# EAGLE design FIDO2AUTH_002 (EAGLE 7.7.0)

## Sheet 1 of 3
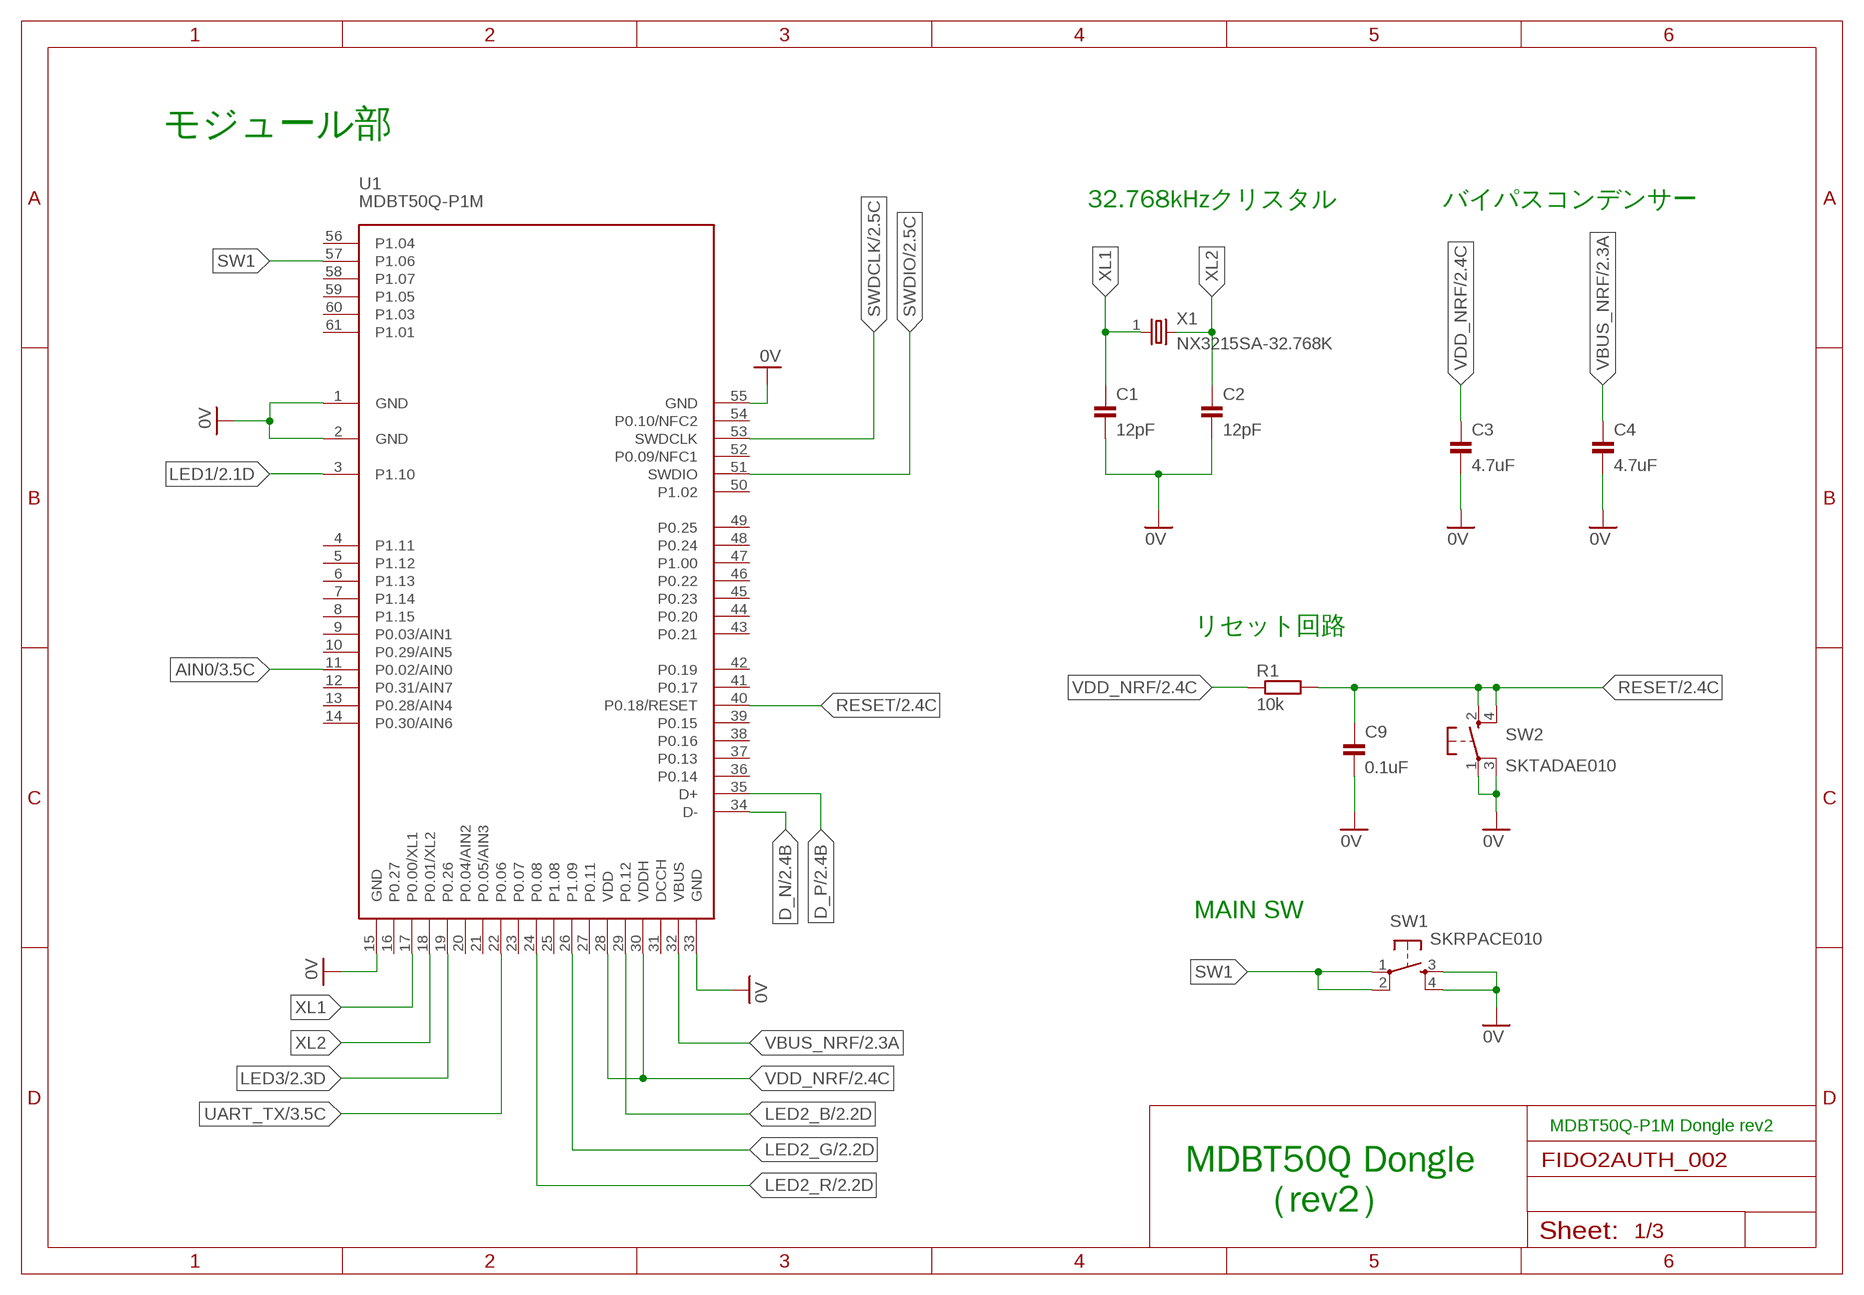
[diagram p0: schematic, sheet 1]

### Parts
C1  12pF  CAP_0603  [C0603K]
C2  12pF  CAP_0603  [C0603K]
C3  4.7uF  CAP_0603  [C0603K]
C4  4.7uF  CAP_0603  [C0603K]
C9  0.1uF  CAP_0603  [C0603K]
R1  10k  RESISTOR_0603  [R0603]
SW1  SKRPACE010  [SKRPACE010]
SW2  SKTADAE010  [SKTADAE010]
U1  MDBT50Q-P1M  [MDBT50Q-P1M]
X1  NX3215SA-32.768K  [NX3215]

### Nets
0V: C1.2 C2.2 C3.2 C4.2 C9.2 SW1.3(S) SW1.4(S1) SW2.1(P) SW2.3(P1) U1.1(GND) U1.2(GND) U1.15(GND) U1.33(GND) U1.55(GND) ; also sheet 2,3
AIN0: U1.11(P0.02/AIN0) ; also sheet 3
D_N: U1.34(D-) ; also sheet 2
D_P: U1.35(D+) ; also sheet 2
LED1: U1.3(P1.10) ; also sheet 2
LED2_B: U1.29(P0.12) ; also sheet 2
LED2_G: U1.26(P1.09) ; also sheet 2
LED2_R: U1.24(P0.08) ; also sheet 2
LED3: U1.19(P0.26) ; also sheet 2
RESET: C9.1 R1.2 SW2.2(S) SW2.4(S1) U1.40(P0.18/RESET) ; also sheet 2
SW1: SW1.1(P) SW1.2(P1) U1.57(P1.06)
SWDCLK: U1.53(SWDCLK) ; also sheet 2
SWDIO: U1.51(SWDIO) ; also sheet 2
UART_TX: U1.22(P0.06) ; also sheet 3
VBUS_NRF: C4.1 U1.32(VBUS) ; also sheet 2,3
VDD_NRF: C3.1 R1.1 U1.28(VDD) U1.30(VDDH) ; also sheet 2,3
XL1: C1.1 U1.17(P0.00/XL1) X1.1
XL2: C2.1 U1.18(P0.01/XL2) X1.2
Unconnected: U1.4(P1.11) U1.5(P1.12) U1.6(P1.13) U1.7(P1.14) U1.8(P1.15) U1.9(P0.03/AIN1) U1.10(P0.29/AIN5) U1.12(P0.31/AIN7) U1.13(P0.28/AIN4) U1.14(P0.30/AIN6) U1.16(P0.27) U1.20(P0.04/AIN2) U1.21(P0.05/AIN3) U1.23(P0.07) U1.25(P1.08) U1.27(P0.11) U1.31(DCCH) U1.36(P0.14) U1.37(P0.13) U1.38(P0.16) U1.39(P0.15) U1.41(P0.17) U1.42(P0.19) U1.43(P0.21) U1.44(P0.20) U1.45(P0.23) U1.46(P0.22) U1.47(P1.00) U1.48(P0.24) U1.49(P0.25) U1.50(P1.02) U1.52(P0.09/NFC1) U1.54(P0.10/NFC2) U1.56(P1.04) U1.58(P1.07) U1.59(P1.05) U1.60(P1.03) U1.61(P1.01)

### Notes on the sheet
- モジュール部
- 32.768kHzクリスタル | バイパスコンデンサー
- リセット回路
- MAIN SW
- MDBT50Q-P1M Dongle rev2
- MDBT50Q Dongle
        （rev2）

## Sheet 2 of 3
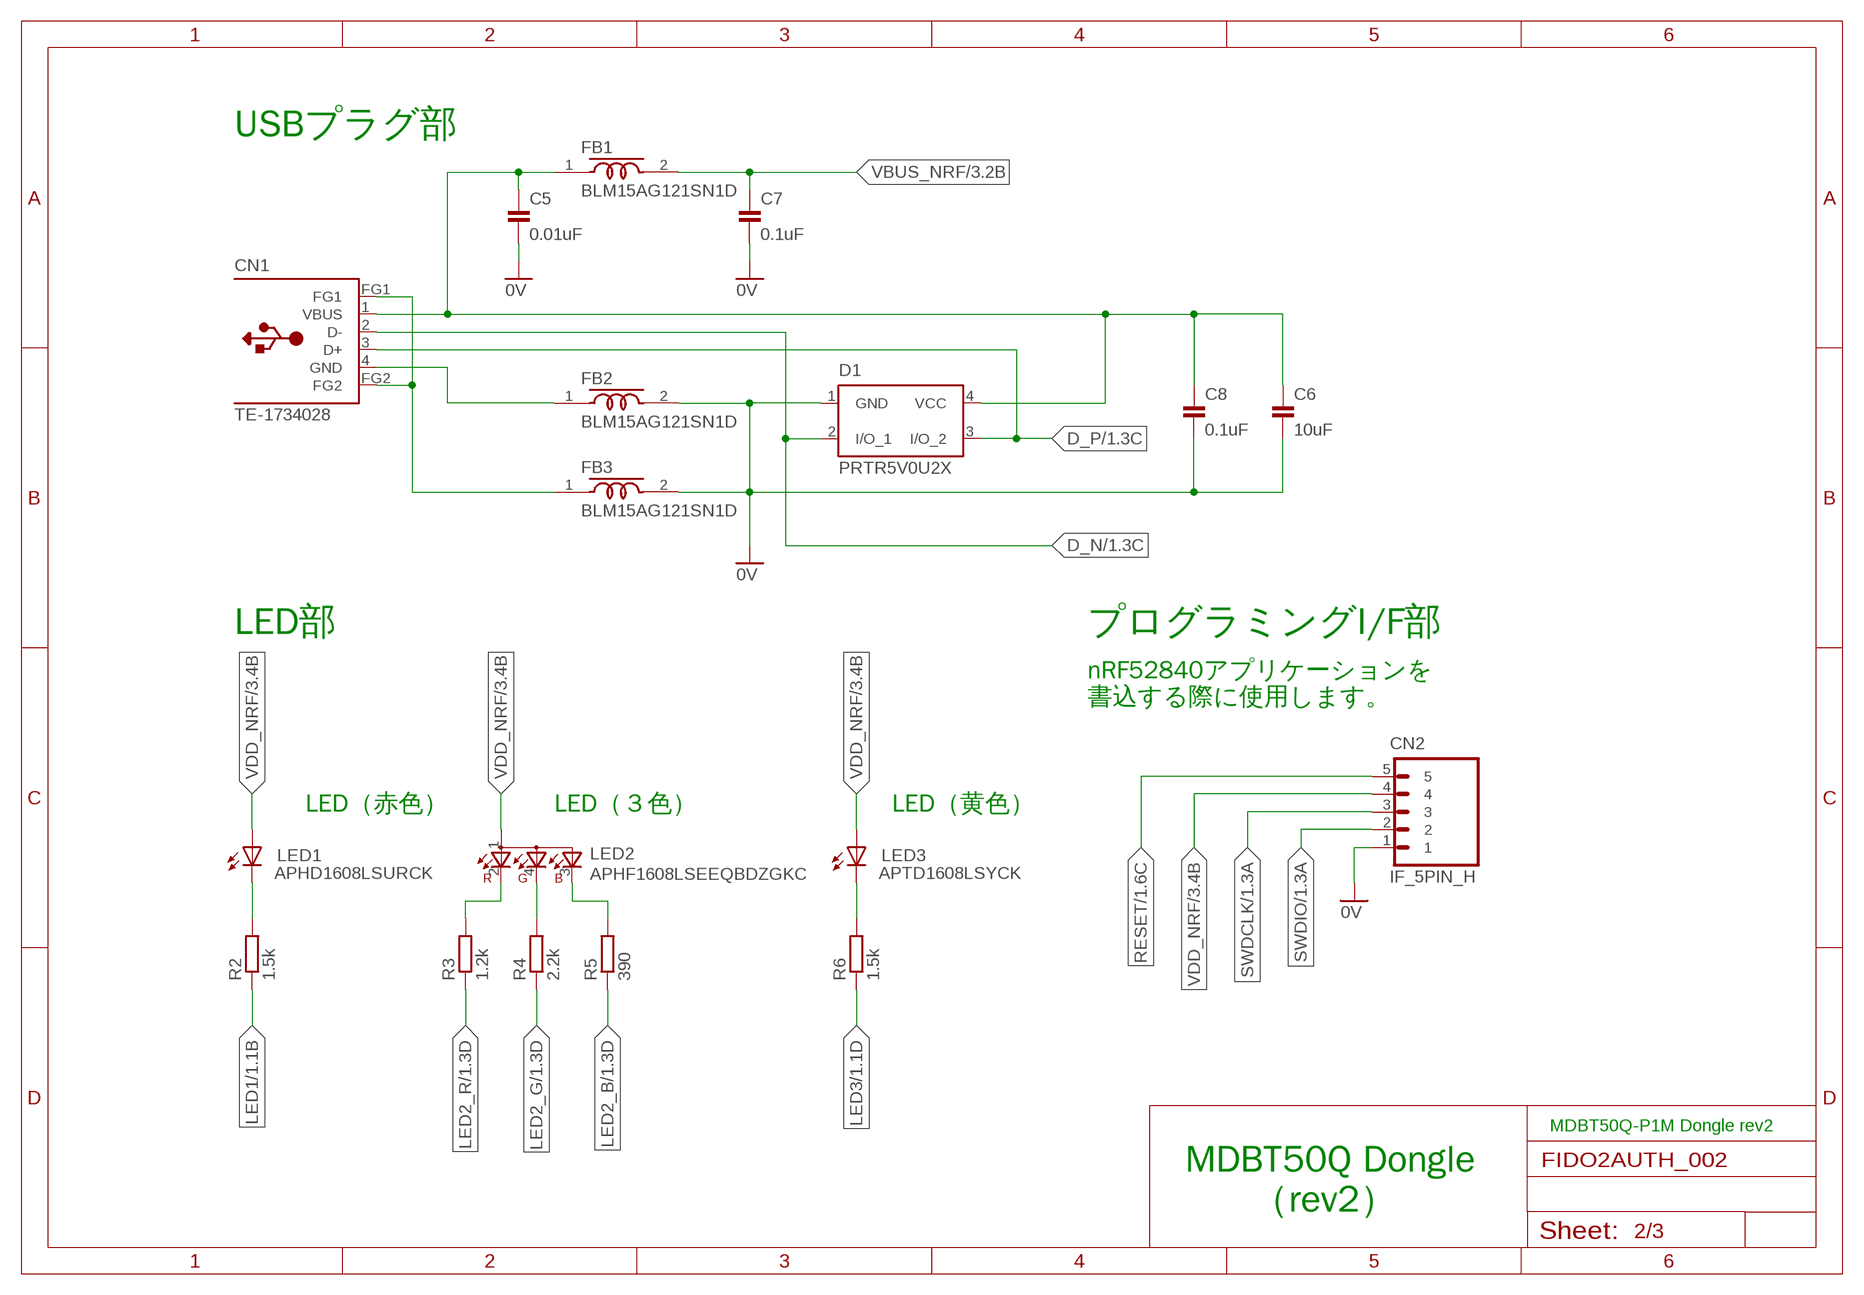
[diagram p1: schematic, sheet 2]

### Parts
C5  0.01uF  CAP_0603  [C0603K]
C6  10uF  CAP_0603  [C0603K]
C7  0.1uF  CAP_0603  [C0603K]
C8  0.1uF  CAP_0603  [C0603K]
CN1  TE-1734028  [TE-1734028]
CN2  IF_5PIN_H  [HEADER_5PIN]
D1  PRTR5V0U2X  [SOT143B]
FB1  BLM15AG121SN1D  [C0402K@1]
FB2  BLM15AG121SN1D  [C0402K@1]
FB3  BLM15AG121SN1D  [C0402K@1]
LED1  APHD1608LSURCK  [CHIPLED_0603]
LED2  APHF1608LSEEQBDZGKC  [APHF1608LSEEQBDZGKC]
LED3  APTD1608LSYCK  [CHIPLED_0603]
R2  1.5k  RESISTOR_0603  [R0603]
R3  1.2k  RESISTOR_0603  [R0603]
R4  2.2k  RESISTOR_0603  [R0603]
R5  390  RESISTOR_0603  [R0603]
R6  1.5k  RESISTOR_0603  [R0603]

### Nets
0V: C5.2 C6.2 C7.2 C8.2 CN2.1 D1.1(GND) FB2.2 FB3.2 ; also sheet 1,3
D_N: CN1.2(D-) D1.2(I/O_1) ; also sheet 1
D_P: CN1.3(D+) D1.3(I/O_2) ; also sheet 1
LED1: R2.1 ; also sheet 1
LED2_B: R5.1 ; also sheet 1
LED2_G: R4.1 ; also sheet 1
LED2_R: R3.1 ; also sheet 1
LED3: R6.1 ; also sheet 1
N$1: LED2.2(CRED) R3.2
N$2: CN1.4(GND) FB2.1
N$3: CN1.FG1 CN1.FG2 FB3.1
N$6: LED2.4(CGREEN) R4.2
N$7: LED2.3(CBLUE) R5.2
N$8: LED3.C R6.2
N$11: LED1.C R2.2
RESET: CN2.5 ; also sheet 1
SWDCLK: CN2.3 ; also sheet 1
SWDIO: CN2.2 ; also sheet 1
VBUS: C5.1 C6.1 C8.1 CN1.1(VBUS) D1.4(VCC) FB1.1
VBUS_NRF: C7.1 FB1.2 ; also sheet 1,3
VDD_NRF: CN2.4 LED1.A LED2.1(A) LED3.A ; also sheet 1,3

### Notes on the sheet
- USBプラグ部
- LED部 | プログラミングI/F部
- nRF52840アプリケーションを
  書込する際に使用します。
- LED（赤色） | LED（３色） | LED（黄色）
- MDBT50Q-P1M Dongle rev2
- MDBT50Q Dongle
        （rev2）

## Sheet 3 of 3
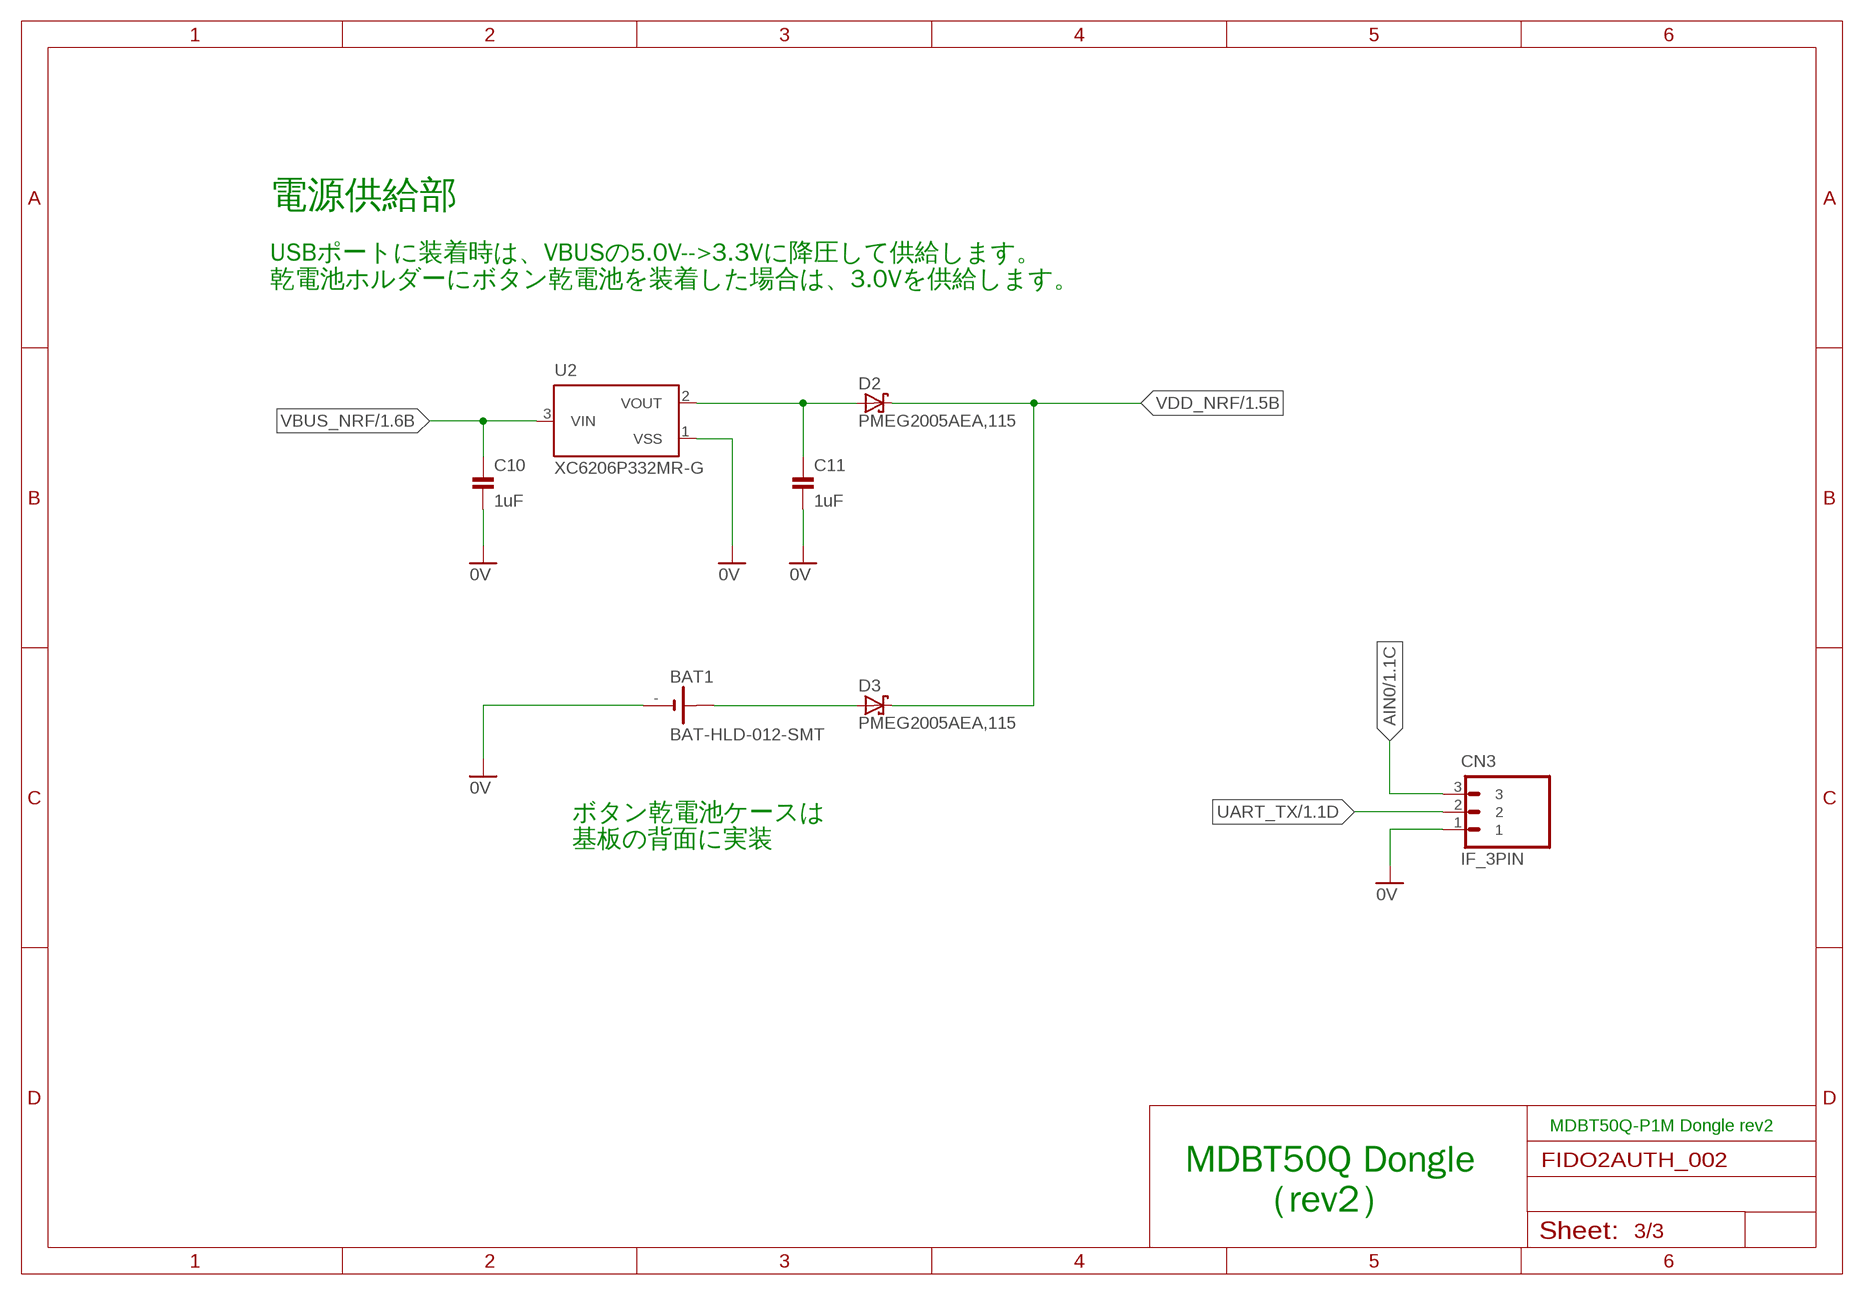
[diagram p2: schematic, sheet 3]

### Parts
BAT1  BAT-HLD-012-SMT  [BAT-HLD-012-SMT]
C10  1uF  CAP_0603  [C0603K]
C11  1uF  CAP_0603  [C0603K]
CN3  IF_3PIN  [HEADER_3PIN]
D2  PMEG2005AEA,115  [SOD323-W]
D3  PMEG2005AEA,115  [SOD323-W]
U2  XC6206P332MR-G  [SOT23]

### Nets
0V: BAT1.- C10.2 C11.2 CN3.1 U2.1(VSS) ; also sheet 1,2
AIN0: CN3.3 ; also sheet 1
N$4: C11.1 D2.A U2.2(VOUT)
N$5: BAT1.+@1(+) D3.A
UART_TX: CN3.2 ; also sheet 1
VBUS_NRF: C10.1 U2.3(VIN) ; also sheet 1,2
VDD_NRF: D2.C D3.C ; also sheet 1,2

### Notes on the sheet
- 電源供給部
- USBポートに装着時は、VBUSの5.0V-->3.3Vに降圧して供給します。
  乾電池ホルダーにボタン乾電池を装着した場合は、3.0Vを供給します。
- ボタン乾電池ケースは
  基板の背面に実装
- MDBT50Q-P1M Dongle rev2
- MDBT50Q Dongle
        （rev2）

## Library data of the parts
BAT1 = Connectors:BAT-HLD-012-SMT: ボタン電池ホルダー(CR1216/1225)
C1-C11 = Parts:CAP: コンデンサー
CN1 = Connectors:TE-1734028: USB connector plug TE Connectivity
CN2 = Connectors:IF_5PIN: 5-pin インターフェース
CN3 = Connectors:IF_3PIN: 3-pin インターフェース
D1 = Parts:PRTR5V0U2X: ESD protection diode
D2 D3 = Parts:PMEG2005: ショットキーダイオード If - 順電流: 500 mA Vrrm - 繰返し逆電圧: 20 V Vf - 順電圧: 0.39 V Ifsm - 順方向サージ電流: 10 A 最低動作温度: - 65 C 最高動作温度: + 150 C
FB1-FB3 = Parts:BLM15AG: フェライトビーズ EMIFIL®
LED1 = Parts:APHD1608: 発光ダイオード
LED2 = Parts:APHF1608: Chip LED RGB Source: http://document.sharpsma.com/files/GM1WA55311A_SS.pdf
LED3 = Parts:APTD1608: 発光ダイオード
R1-R6 = Parts:RESISTOR: 抵抗器
SW1 = Parts:SKRPACE010: 表面実装用タクトスイッチ ４．２×３．２ｍｍ小型重作動力タイプ ・作動力：２．５５Ｎ ・操作方向：垂直 ・移動量：０．２ｍｍ ・動作寿命：５０，０００ｃｙｃｌｅｓ （５ｍＡ ５ＶＤＣ） ・初期接触抵抗：最大５００ｍΩ
SW2 = Parts:SKTADAE010: 表面実装用タクトスイッチ 2.6×1.6ｍｍ小型重作動力タイプ ・作動力：2.4 N ・操作方向：垂直 ・移動量：0.11 mm ・定格：50 mA 12 VDC
U1 = Modules:MDBT50Q-P1M: MDBT50Q – P1M (PCB Antenna) Bluetooth 5, IEEE 802.15.4, 2.4 GHz transceiver ARM Cortex –M4 32-bit processor with FPU, 64 MHz Memory: 1MB flash / 256KB RAM ‧Supply voltage range 1.7V to 5.5V ‧On-chip DC/DC and LDO regulators with automated low current modes ‧Regulated supply for external components from 1.8V to 3.3V ‧0.4uA at 3V in System OFF mode, no RAM retention ‧1.5uA at 3V in System ON mode, no RAM retention, wake on RTC Working distance 1Mbps: up to 250 meters in open space 2Mbps: up to 120 meters in open space
U2 = Parts:XC6206: LDO電圧レギュレータ 出力電圧: 3.3 V 出力電流: 200 mA 入力電圧最大値: 6 V 最小入力電圧: 1.8 V 動作供給電流: 1 uA 最低動作温度: - 40 C 最高動作温度: + 85 C
X1 = Parts:NX3215SA: 水晶振動子 周波数 32.768kHz 周波数公差 ±20ppm 負荷容量 6pF ESR（等価直列抵抗） 70 kOhms 動作温度 -40°C～85°C

## Board
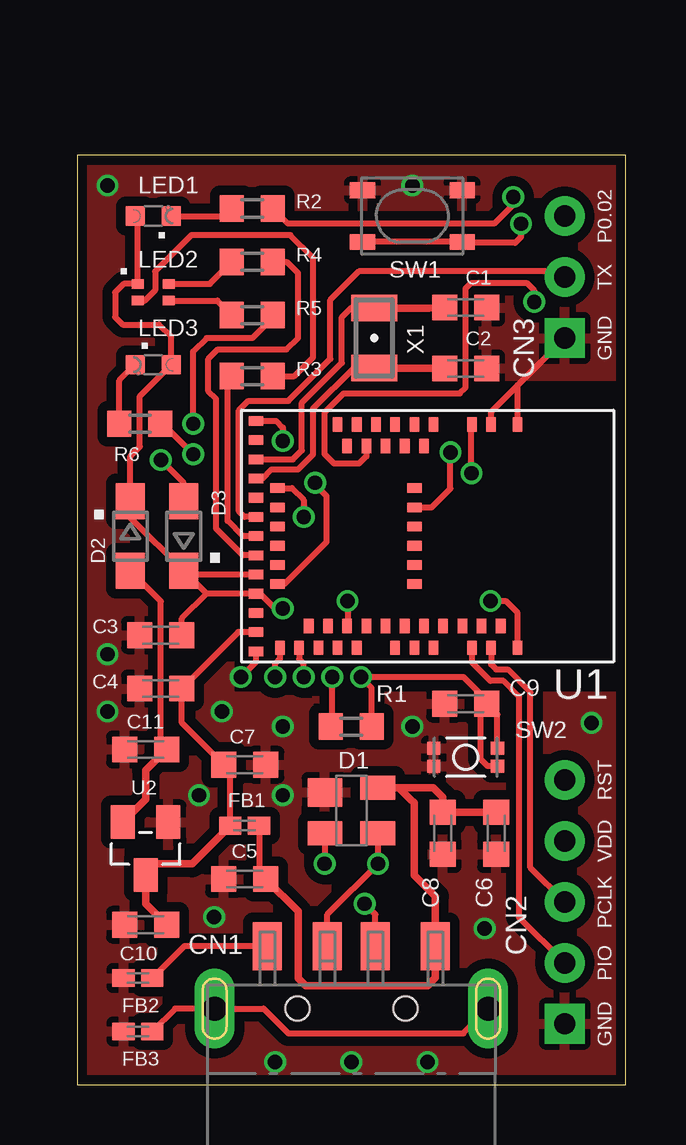
[diagram p3: board, top side]
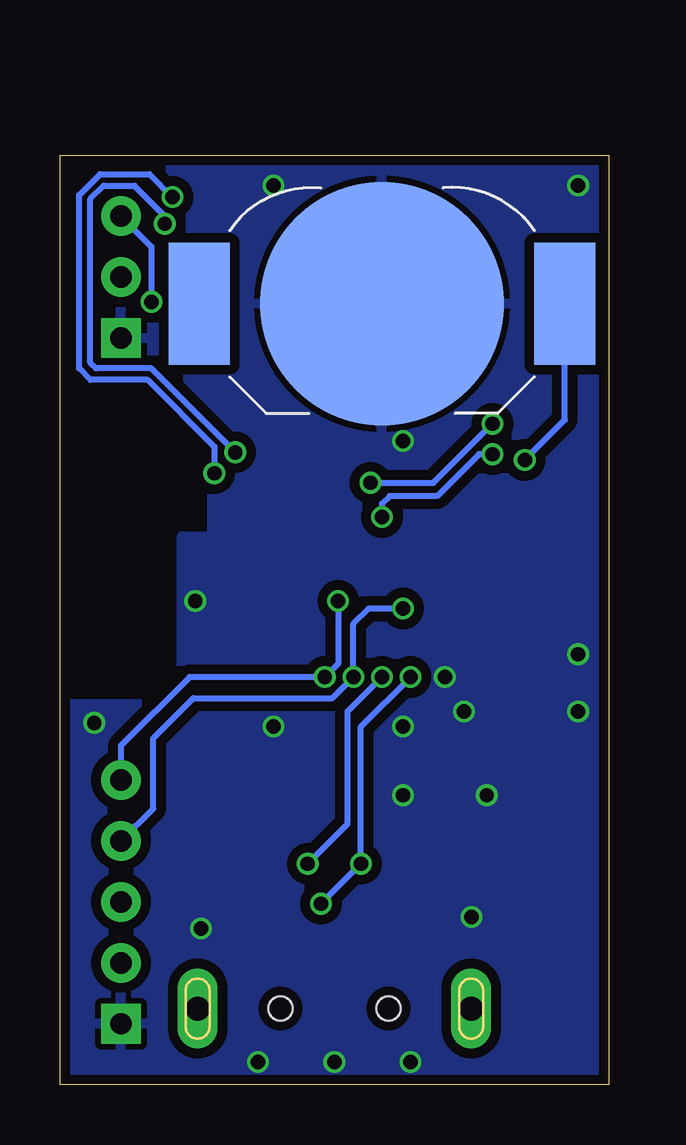
[diagram p4: board, bottom side, seen from below]

Size 22.86 x 38.73 mm. Coordinates in mm from the lower left corner, seen from the top.
Outline: 0,0 22.86,0 22.86,38.73 0,38.73 0,0
Copper layers (1*16): Top 0.035mm / dielectric 1.5mm / Bottom 0.035mm
Design rules "SeeedStudio_2layer_DRU_no_angle_20140221": minimum track width 6mil, minimum drill 12mil, track to track 6mil, track to pad 6mil, pad to pad 6mil, via to via 6mil, smd to smd 0mil, copper to edge 10mil, drill to drill 10mil, minimum pad ring 10mil, minimum via ring 6mil, stop-mask expansion 2mil, vias tented up to drill 100mil, thermal gap 10mil

### Footprints (pad centres in the part's own frame; a part is rotated, then mirrored left to right if it is on the bottom)
BAT-HLD-012-SMT = smd 2.54 x 5.08: +@1 -7.62,0; +@2 7.62,0 | smd 10.16 x 10.16: - 0,0
C0603K = smd 1.05 x 1.08: 1 -0.875,0; 2 0.875,0
TE-1734028 = smd 1.2 x 2: 1 3.5,2.6; 2 1,2.6; 3 -1,2.6; 4 -3.5,2.6 | drill 1 pad 1.676 long: FG1 5.7,0; FG2 -5.7,0 | hole 1: -2.25,0; 2.25,0
HEADER_5PIN = drill 0.889 pad 1.651 square: 1 0,0 | drill 0.889 pad 1.651: 2 2.54,0; 3 5.08,0; 4 7.62,0; 5 10.16,0
HEADER_3PIN = drill 0.889 pad 1.651 square: 1 0,0 | drill 0.889 pad 1.651: 2 2.54,0; 3 5.08,0
SOT143B = smd 1.2 x 1.44: 1 -0.75,-1.1 | smd 1 x 1.44: 2 0.95,-1.1; 3 0.95,1.1; 4 -0.95,1.1
SOD323-W = smd 1.5 x 1.2: A 1.45,0; C -1.45,0
C0402K@1 = smd 0.925 x 0.74: 1 -0.6,0; 2 0.6,0
CHIPLED_0603 = smd 0.8 x 0.8: A -0.75,0; C 0.75,0
APHF1608LSEEQBDZGKC = smd 0.5 x 0.4: 1 -0.65,0.35; 2 -0.65,-0.35; 3 0.65,-0.35; 4 0.65,0.35
R0603 = smd 1 x 1.1: 1 -0.85,0; 2 0.85,0
SKRPACE010 = smd 1.05 x 0.65: 1 -2.075,1.075; 2 2.075,1.075; 3 -2.075,-1.075; 4 2.075,-1.075
SKTADAE010 = smd 0.55 x 0.55: 1 -1.325,0.375; 2 1.325,0.375; 3 -1.325,-0.375; 4 1.325,-0.375
MDBT50Q-P1M = smd 0.6 x 0.4: 1 -4.65,3.75; 2 -4.65,2.65; 3 -4.65,1.85; 4 -4.65,0.25; 5 -3.75,-0.15; 6 -4.65,-0.55; 7 -3.75,-0.95; 8 -4.65,-1.35; 9 -3.75,-1.75; 10 -4.65,-2.15; 11 -3.75,-2.55; 12 -4.65,-2.95; 13 -3.75,-3.35; 14 -4.65,-3.75; 34 4.65,-6.15; 35 4.65,-5.35; 36 3.75,-4.95; 37 4.65,-4.55; 38 3.75,-4.15; 39 4.65,-3.75; 40 3.75,-3.35; 41 4.65,-2.95; 42 3.75,-2.55; 43 3.75,-1.75; 44 4.65,-1.35; 45 3.75,-0.95; 46 4.65,-0.55; 47 3.75,-0.15; 48 4.65,0.25; 49 3.75,0.65; 50 3.75,1.45; 51 4.65,1.85; 52 3.75,2.25; 53 4.65,2.65; 54 3.75,3.05; 55 4.65,3.75 | smd 0.4 x 0.6: 15 -4.8,-7.15; 16 -4,-7.15; 17 -3.2,-7.15; 18 -2.4,-7.15; 19 -2,-6.25; 20 -1.6,-7.15; 21 -1.2,-6.25; 22 -0.8,-7.15; 23 -0.4,-6.25; 24 0,-7.15; 25 0.4,-6.25; 26 0.8,-7.15; 27 1.2,-6.25; 28 1.6,-7.15; 29 2,-6.25; 30 2.4,-7.15; 31 3.2,-7.15; 32 4,-7.15; 33 4.8,-7.15; 56 -2,-0.55; 57 -1.2,-0.55; 58 -0.4,-0.55; 59 0.4,-0.55; 60 1.2,-0.55; 61 2,-0.55
SOT23 = smd 1 x 1.4: 1 -0.95,-1.1; 2 0.95,-1.1; 3 0,1.1
NX3215 = smd 1.1 x 1.9: 1 -1.25,0; 2 1.25,0

### Placement (x,y rotation side)
BAT1  9.45,32.54 180 bottom
C1  16.19,32.38 0 top
C2  16.19,29.84 0 top
C3  3.49,18.73 180 top
C4  3.49,16.51 180 top
C5  6.99,8.57 180 top
C6  17.46,10.48 270 top
C7  6.99,13.34 0 top
C8  15.24,10.48 270 top
C9  16.19,15.88 180 top
C10  2.86,6.67 180 top
C11  2.86,13.97 180 top
CN1  11.43,3.17 0 top
CN2  20.32,2.54 90 top
CN3  20.32,31.11 90 top
D1  11.43,11.43 270 top
D2  2.22,22.86 270 top
D3  4.45,22.86 90 top
FB1  6.99,10.79 180 top
FB2  2.54,4.45 180 top
FB3  2.54,2.22 180 top
LED1  3.17,36.2 0 top
LED2  3.17,33.02 0 top
LED3  3.17,30 180 top
R1  11.43,14.92 0 top
R2  7.3,36.51 180 top
R3  7.3,29.53 0 top
R4  7.3,34.29 180 top
R5  7.3,32.07 180 top
R6  2.62,27.54 180 top
SW1  13.97,36.2 180 top
SW2  16.19,13.65 0 top
U1  14.61,22.86 270 top
U2  2.86,9.84 180 top
X1  12.38,31.11 270 top

### Tracks (layer width: path | path; a pad name or v marks a point on that pad's centre or on a via)
0V  (via drill 0.6)
  Top 0.254: U1.55 18.36,19.67 17.86,20.16 v17.22,20.16 | U1.15 8.3,27.66 8.57,27.38 v8.57,26.83 | U1.33 7.46,17.61 v6.83,16.99 | U1.1 18.36,29.15 | 18.36,29.15 CN3.1 | U1.2 17.25,28.05 18.36,29.15
  other vias: 13.97,14.92 16.99,6.51 5.71,6.99 11.43,0.95 8.57,14.92 5.08,12.06 1.27,17.94 1.27,15.56 21.43,15.08 14.61,0.95 8.26,0.95 13.97,37.47 8.57,12.06 1.27,37.47 6.03,15.56
  pour Bottom (isolate 0.406, rank 3): -1.27,-1.27 24.13,-1.27 24.13,15.88 17.78,15.88 17.78,22.86 16.51,22.86 16.51,26.04 17.78,26.04 17.78,29.84 24.13,29.84 24.13,40.64 -1.27,40.64
  pour Top (isolate 0.406, rank 3): -2.54,41.91 25.4,41.91 25.4,29.53 6.35,29.53 6.35,16.19 25.4,16.19 25.4,-2.54 -2.54,-2.54
AIN0  (via drill 0.6)
  Top 0.254: U1.11 12.05,26.18 11.75,25.88 10.72,25.88 10.32,26.27 10.32,28.02 11.11,28.81 15.95,28.81 16.19,29.05 16.19,33.18 16.43,33.42 18.73,33.42 19.05,33.1 v19.05,32.62
  Bottom 0.254: CN3.3 19.05,34.92 v19.05,32.62
D_N  (via drill 0.6)
  Top 0.254: CN1.2 12.43,7.1 v11.99,7.54 | v8.26,16.99 8.26,17.54 8.46,17.74 U1.34 | D1.2 v10.33,9.22 v10.32,9.21
  Bottom 0.254: v8.26,16.99 10.32,14.92 v10.32,9.21 v11.99,7.54
D_P  (via drill 0.6)
  Top 0.254: CN1.3 10.43,7.1 v12.54,9.21 v12.53,9.22 D1.3 | v9.45,16.99 9.45,17.54 9.26,17.73 U1.35
  Bottom 0.254: v12.54,9.21 10.87,10.87 10.87,15.56 v9.45,16.99
LED1  (via drill 0.6)
  Top 0.254: R2.1 8.79,35.88 17.38,35.88 18.18,36.67 v18.18,36.99 | v16.43,25.48 16.43,27.49 U1.3
  Bottom 0.254: v18.18,36.99 19.13,37.94 21.19,37.94 22.07,37.07 22.07,29.84 21.59,29.37 19.21,29.37 16.43,26.59 v16.43,25.48
LED2_B  (via drill 0.6)
  Top 0.254: U1.29 8.64,20.86 10.4,22.62 10.4,24.53 9.92,25 v9.92,25.08 | R5.1 8.15,31.96 7.3,31.11 5.4,31.11 4.84,30.56 v4.84,27.54
  Bottom 0.254: v9.92,25.08 7.3,25.08 v4.84,27.54
LED2_G
  Top 0.254: U1.26 6.91,22.06 5.79,23.18 5.79,28.57 5.48,28.89 5.48,30.24 5.87,30.64 8.73,30.64 9.21,31.11 9.21,33.81 8.73,34.29 R4.1
LED2_R
  Top 0.254: U1.24 6.91,22.86 6.27,23.5 6.27,29.66 R3.1
LED3  (via drill 0.6)
  Top 0.254: U1.19 8.95,24.86 9.45,24.37 v9.45,23.65 | R6.1 3.57,27.54 v4.84,26.27
  Bottom 0.254: v4.84,26.27 5.4,26.27 7.14,24.53 9.13,24.53 9.45,24.21 v9.45,23.65
N$1
  Top 0.254: LED2.2 2.83,32.67 3.25,33.1 3.25,33.89 4.76,35.4 8.89,35.4 9.84,34.45 9.84,30.32 9.05,29.53 R3.2
N$2
  Top 0.254: CN1.4 4.47,5.78 FB2.1
N$3
  Top 0.254: CN1.FG1 16.1,2.14 8.81,2.14 7.78,3.17 CN1.FG2 4.09,3.17 FB3.1
N$4
  Top 0.254: C11.1 3.49,14.21 3.49,20.14 D2.A
  Top 0.305: U2.2 2.86,11.89 2.86,13.1 C11.1
N$5  (via drill 0.6)
  Top 0.254: D3.A 4.45,25.08 v3.49,26.04
  Bottom 0.254: v3.49,26.04 1.83,27.7 BAT1.+@1
N$6
  Top 0.254: 6.11,34.29 R4.2 5.53,33.37 LED2.4
N$7
  Top 0.254: LED2.3 5.85,32.67 R5.2
N$8
  Top 0.254: R6.2 1.77,29.35 LED3.C
N$11
  Top 0.254: LED1.C 6.13,36.2 R2.2
RESET  (via drill 0.6)
  Top 0.254: v11.27,20.16 11.27,19.13 U1.40 | C9.1 17.07,16.03 16.11,16.99 v11.83,16.99 12.28,16.53 R1.2 | SW2.2 17.52,15.43 C9.1 | SW2.4 17.12,13.28 16.83,13.57 16.83,15.63 C9.1
  Bottom 0.254: v11.27,20.16 11.27,17.54 v11.83,16.99 17.46,16.99 20.32,14.13 CN2.5
SW1  (via drill 0.6)
  Top 0.254: U1.57 14.77,24.06 15.56,24.84 v15.56,26.35 | v18.49,35.88 18.49,35.32 18.26,35.08 16.08,35.08 SW1.1 SW1.2
  Bottom 0.254: v15.56,26.35 19.05,29.84 21.35,29.84 21.59,30.08 21.59,36.91 21.03,37.47 19.76,37.47 18.49,36.2 v18.49,35.88
SWDCLK
  Top 0.254: CN2.3 18.89,9.05 18.89,16.35 17.94,17.3 17.46,17.3 17.25,17.51 U1.53
SWDIO
  Top 0.254: CN2.2 18.41,6.99 18.41,16.19 17.78,16.83 17.22,16.83 16.45,17.6 U1.51
UART_TX
  Top 0.254: U1.22 6.98,23.66 6.75,23.89 6.75,28.1 7.14,28.5 8.81,28.5 10.56,30.24 10.56,32.7 11.75,33.89 20.08,33.89 CN3.2
VBUS
  Top 0.254: FB1.1 7.58,8.85 C5.1
  Top 0.305: C8.1 C6.1 | C8.1 15.16,11.35 | D1.4 13.41,12.38 | 13.41,12.38 14.85,12.38 15.24,11.99 C8.1 | 13.41,12.38 13.89,11.91 14.05,11.75 14.05,8.73 14.93,7.85 CN1.1 14.93,4.45 14.61,4.13 9.53,4.13 9.21,4.45 9.21,7.22 C5.1
VBUS_NRF
  Top 0.254: U1.32 6.72,18.86 C4.1 4.37,15.08 C7.1 6.38,13.06 FB1.2
  Top 0.305: C10.1 2.86,7.54 U2.3 3.32,9.21 4.8,9.21 FB1.2
VDD_NRF  (via drill 0.6)
  Top 0.254: v8.57,19.84 8.26,19.84 7.64,20.46 U1.30 5.39,20.46 | R1.1 10.64,14.98 v10.64,16.99 | 5.39,20.46 D3.C | 6.51,21.26 U1.28 4.59,21.26 D3.C | C3.1 4.37,19.43 5.39,20.46 | LED1.A 2.52,36.09 LED2.1 1.94,33.37 1.59,33.02 1.59,31.99 1.91,31.67 3.41,31.67 3.92,31.16 LED3.A 2.62,28.7 2.62,26.59 2.22,26.19 D2.C 2.22,23.63 D3.C
  Bottom 0.254: v8.57,19.84 10,19.84 10.64,19.21 v10.64,16.99 11.51,16.11 17.3,16.11 18.97,14.45 18.97,11.51 CN2.4
XL1
  Top 0.254: U1.17 8.99,26.06 9.37,26.43 9.37,28.42 11.03,30.08 11.03,31.99 11.41,32.37 X1.1
  Top 0.305: X1.1 14.66,32.37 C1.1
XL2
  Top 0.254: U1.18 7.72,25.26 8.1,25.64 9.21,25.64 9.84,26.27 9.84,28.18 11.53,29.86 X1.2
  Top 0.305: X1.2 14.66,29.86 C2.1

### Text on the board
tPlace: P0.02 | TX | GND | RST | VDD | PCLK | PIO | GND